# EasyEDA schematic OpenRTVC_Allumage_Moteur.json
TITLE: Allumage; REV: 1.0; Date: 2020-06-16; Sheet: 1/1; Company: OpenRTVC
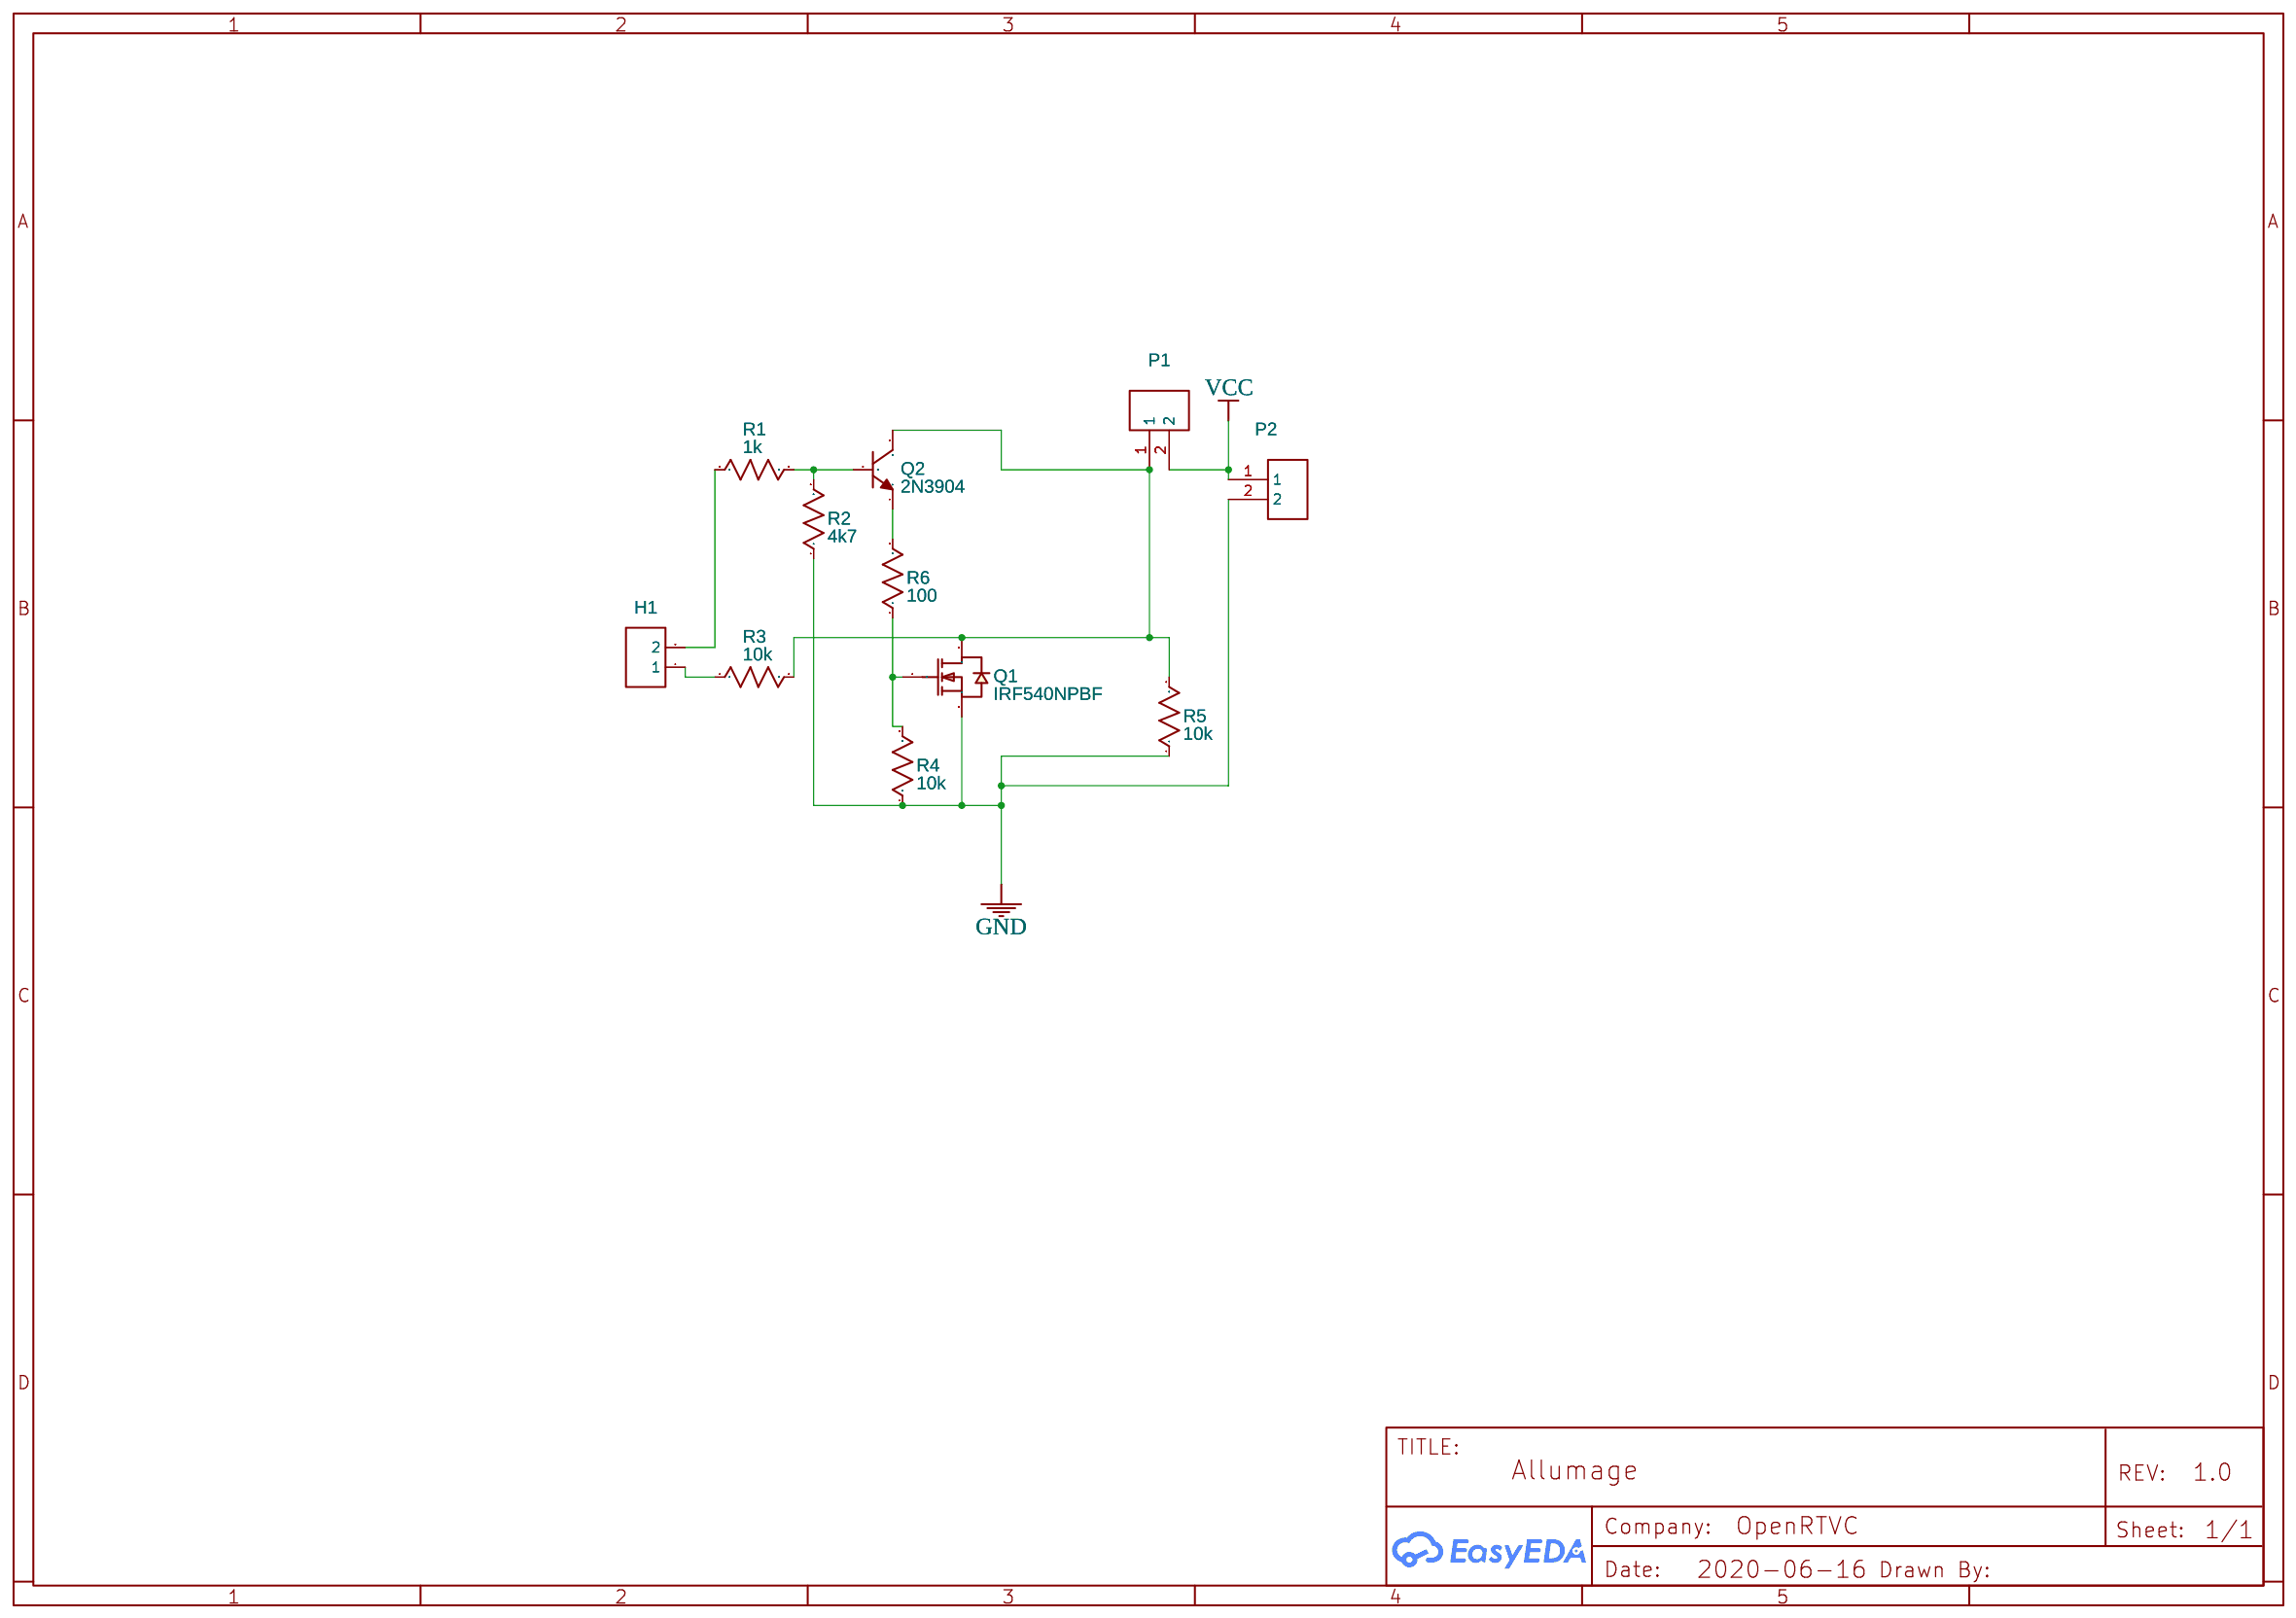
[diagram p0: schematic sheet]

## Parts
H1  HDR-F-2.54_1x2  [HDR-M-2.54_1X2]
P1  WJ301V-5.0-2P  [CONN-TH_2P-P5.00_WJ301V-5.00-2P]
P2  WJ301V-5.0-2P  [CONN-TH_2P-P5.00_WJ301V-5.00-2P]
Q1  IRF540NPBF  [TO-220-3_L10.0-W4.5-P2.54-L]
Q2  2N3904  [TO-92-3_L5.1-W4.1-P1.27-L]
R1  1k  [R_AXIAL-0.4]
R2  4k7  [R_AXIAL-0.4]
R3  10k  [R_AXIAL-0.4]
R4  10k  [R_AXIAL-0.4]
R5  10k  [R_AXIAL-0.4]
R6  100  [R_AXIAL-0.4]

## Library data of the parts
H1 = HDR-F-2.54_1x2: Supplier Part: C49661; Supplier: LCSC; Contributor: LCEDA_Lib
P1 P2 = WJ301V-5.0-2P: Supplier: LCSC; Manufacturer: ReliaPro; image: //image.lceda.cn/szlcsc/C8475.jpg; Supplier Part: C8475
Q1 = IRF540NPBF: Supplier: LCSC; Manufacturer: Infineon; image: //image.lceda.cn/szlcsc/C2566.jpg; Supplier Part: C2566
Q2 = 2N3904: Supplier: LCSC; Manufacturer: SEMTECH; Supplier Part: C118538
R1-R6 = R_0201_US: Contributor: LCEDA_Lib

## Nets
GND: P2.2 Q1.3(S) R2.1 R4.1 R5.1
VCC: P1.2 P2.1
Net-(H1-1): H1.1 R3.1
Net-(H1-2): H1.2 R1.1
Net-(P1-1): P1.1 Q1.2(D) Q2.3(C) R3.2 R5.2
Net-(Q1-1): Q1.1(G) R4.2 R6.1
Net-(Q2-1): Q2.1(E) R6.2
Net-(Q2-2): Q2.2(B) R1.2 R2.2
